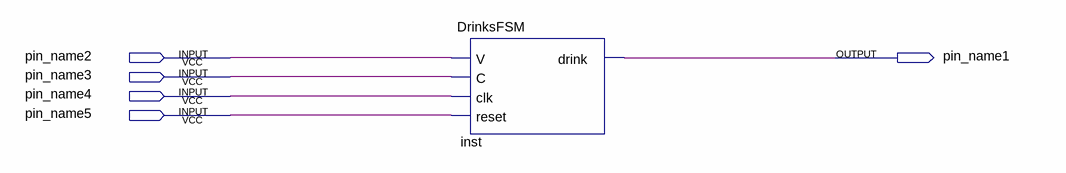
[diagram p0: schematic sheet]
// Quartus schematic DrinksMachine.bdf as structural Verilog: 1 symbols, 5 pins
module DrinksMachine (
  input  pin_name2,
  input  pin_name3,
  input  pin_name4,
  input  pin_name5,
  output pin_name1
);

  DrinksFSM inst (.V(pin_name2), .C(pin_name3), .clk(pin_name4), .reset(pin_name5), .drink(pin_name1));
endmodule
